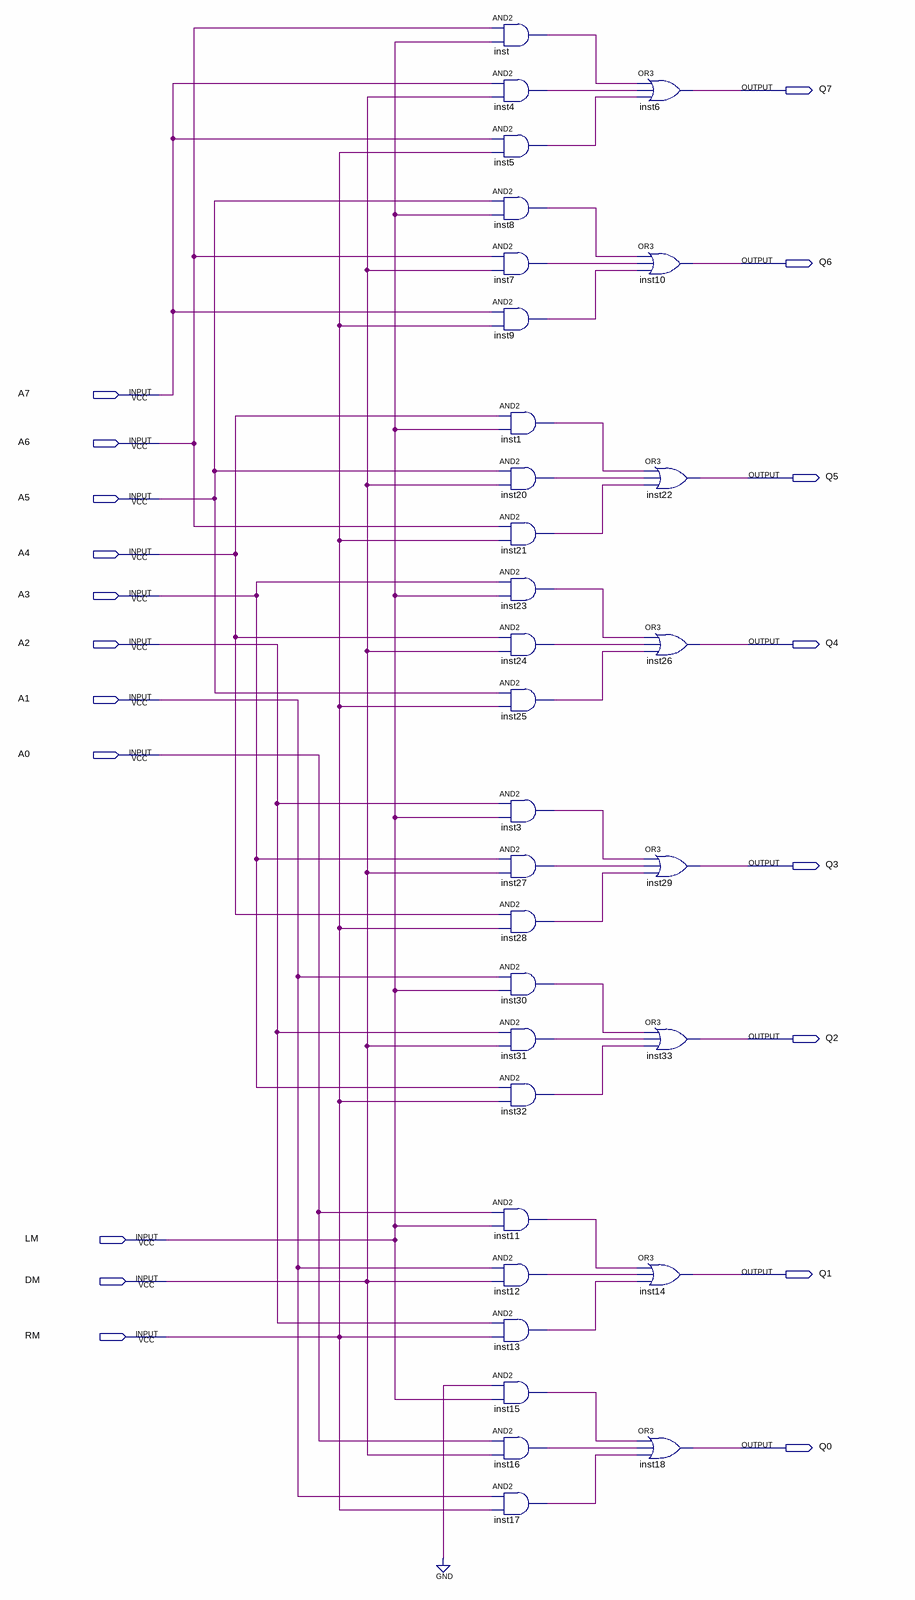
[diagram p0: schematic sheet]
// Quartus schematic SHR_8ASR.bdf as structural Verilog: 32 symbols, 19 pins
module SHR_8ASR (
  input  A7,
  input  A6,
  input  A5,
  input  A4,
  input  A3,
  input  A2,
  input  A1,
  input  A0,
  input  LM,
  input  DM,
  input  RM,
  output Q7,
  output Q6,
  output Q5,
  output Q4,
  output Q3,
  output Q2,
  output Q1,
  output Q0
);

  wire inst1_out, inst3_out, inst4_out, inst5_out, inst7_out, inst8_out, inst9_out, inst11_out, inst12_out,
       inst13_out, inst15_out, inst16_out, inst17_out, inst20_out, inst21_out, inst23_out, inst24_out,
       inst25_out, inst27_out, inst28_out, inst30_out, inst31_out, inst32_out, inst_out;

  and inst (inst_out, A6, LM);
  and inst4 (inst4_out, A7, DM);
  and inst5 (inst5_out, A7, RM);
  and inst8 (inst8_out, A5, LM);
  and inst7 (inst7_out, A6, DM);
  and inst9 (inst9_out, A7, RM);
  and inst11 (inst11_out, A0, LM);
  and inst12 (inst12_out, A1, DM);
  and inst13 (inst13_out, A2, RM);
  and inst15 (inst15_out, 1'b0, LM);
  and inst16 (inst16_out, A0, DM);
  and inst17 (inst17_out, A1, RM);
  and inst1 (inst1_out, A4, LM);
  and inst20 (inst20_out, A5, DM);
  and inst21 (inst21_out, A6, RM);
  and inst23 (inst23_out, A3, LM);
  and inst24 (inst24_out, A4, DM);
  and inst25 (inst25_out, A5, RM);
  and inst3 (inst3_out, A2, LM);
  and inst27 (inst27_out, A3, DM);
  and inst28 (inst28_out, A4, RM);
  and inst30 (inst30_out, A1, LM);
  and inst31 (inst31_out, A2, DM);
  and inst32 (inst32_out, A3, RM);
  or inst6 (Q7, inst_out, inst4_out, inst5_out);
  or inst10 (Q6, inst8_out, inst7_out, inst9_out);
  or inst22 (Q5, inst1_out, inst20_out, inst21_out);
  or inst26 (Q4, inst23_out, inst24_out, inst25_out);
  or inst29 (Q3, inst3_out, inst27_out, inst28_out);
  or inst33 (Q2, inst30_out, inst31_out, inst32_out);
  or inst14 (Q1, inst11_out, inst12_out, inst13_out);
  or inst18 (Q0, inst15_out, inst16_out, inst17_out);
endmodule
